# EasyEDA schematic EasyEDA_Source.json
TITLE: Project Lab; REV: v3.e; Date: 2023.03; Sheet: 1/1; Drawn By: bryan costanich; Company: Wilderness Labs
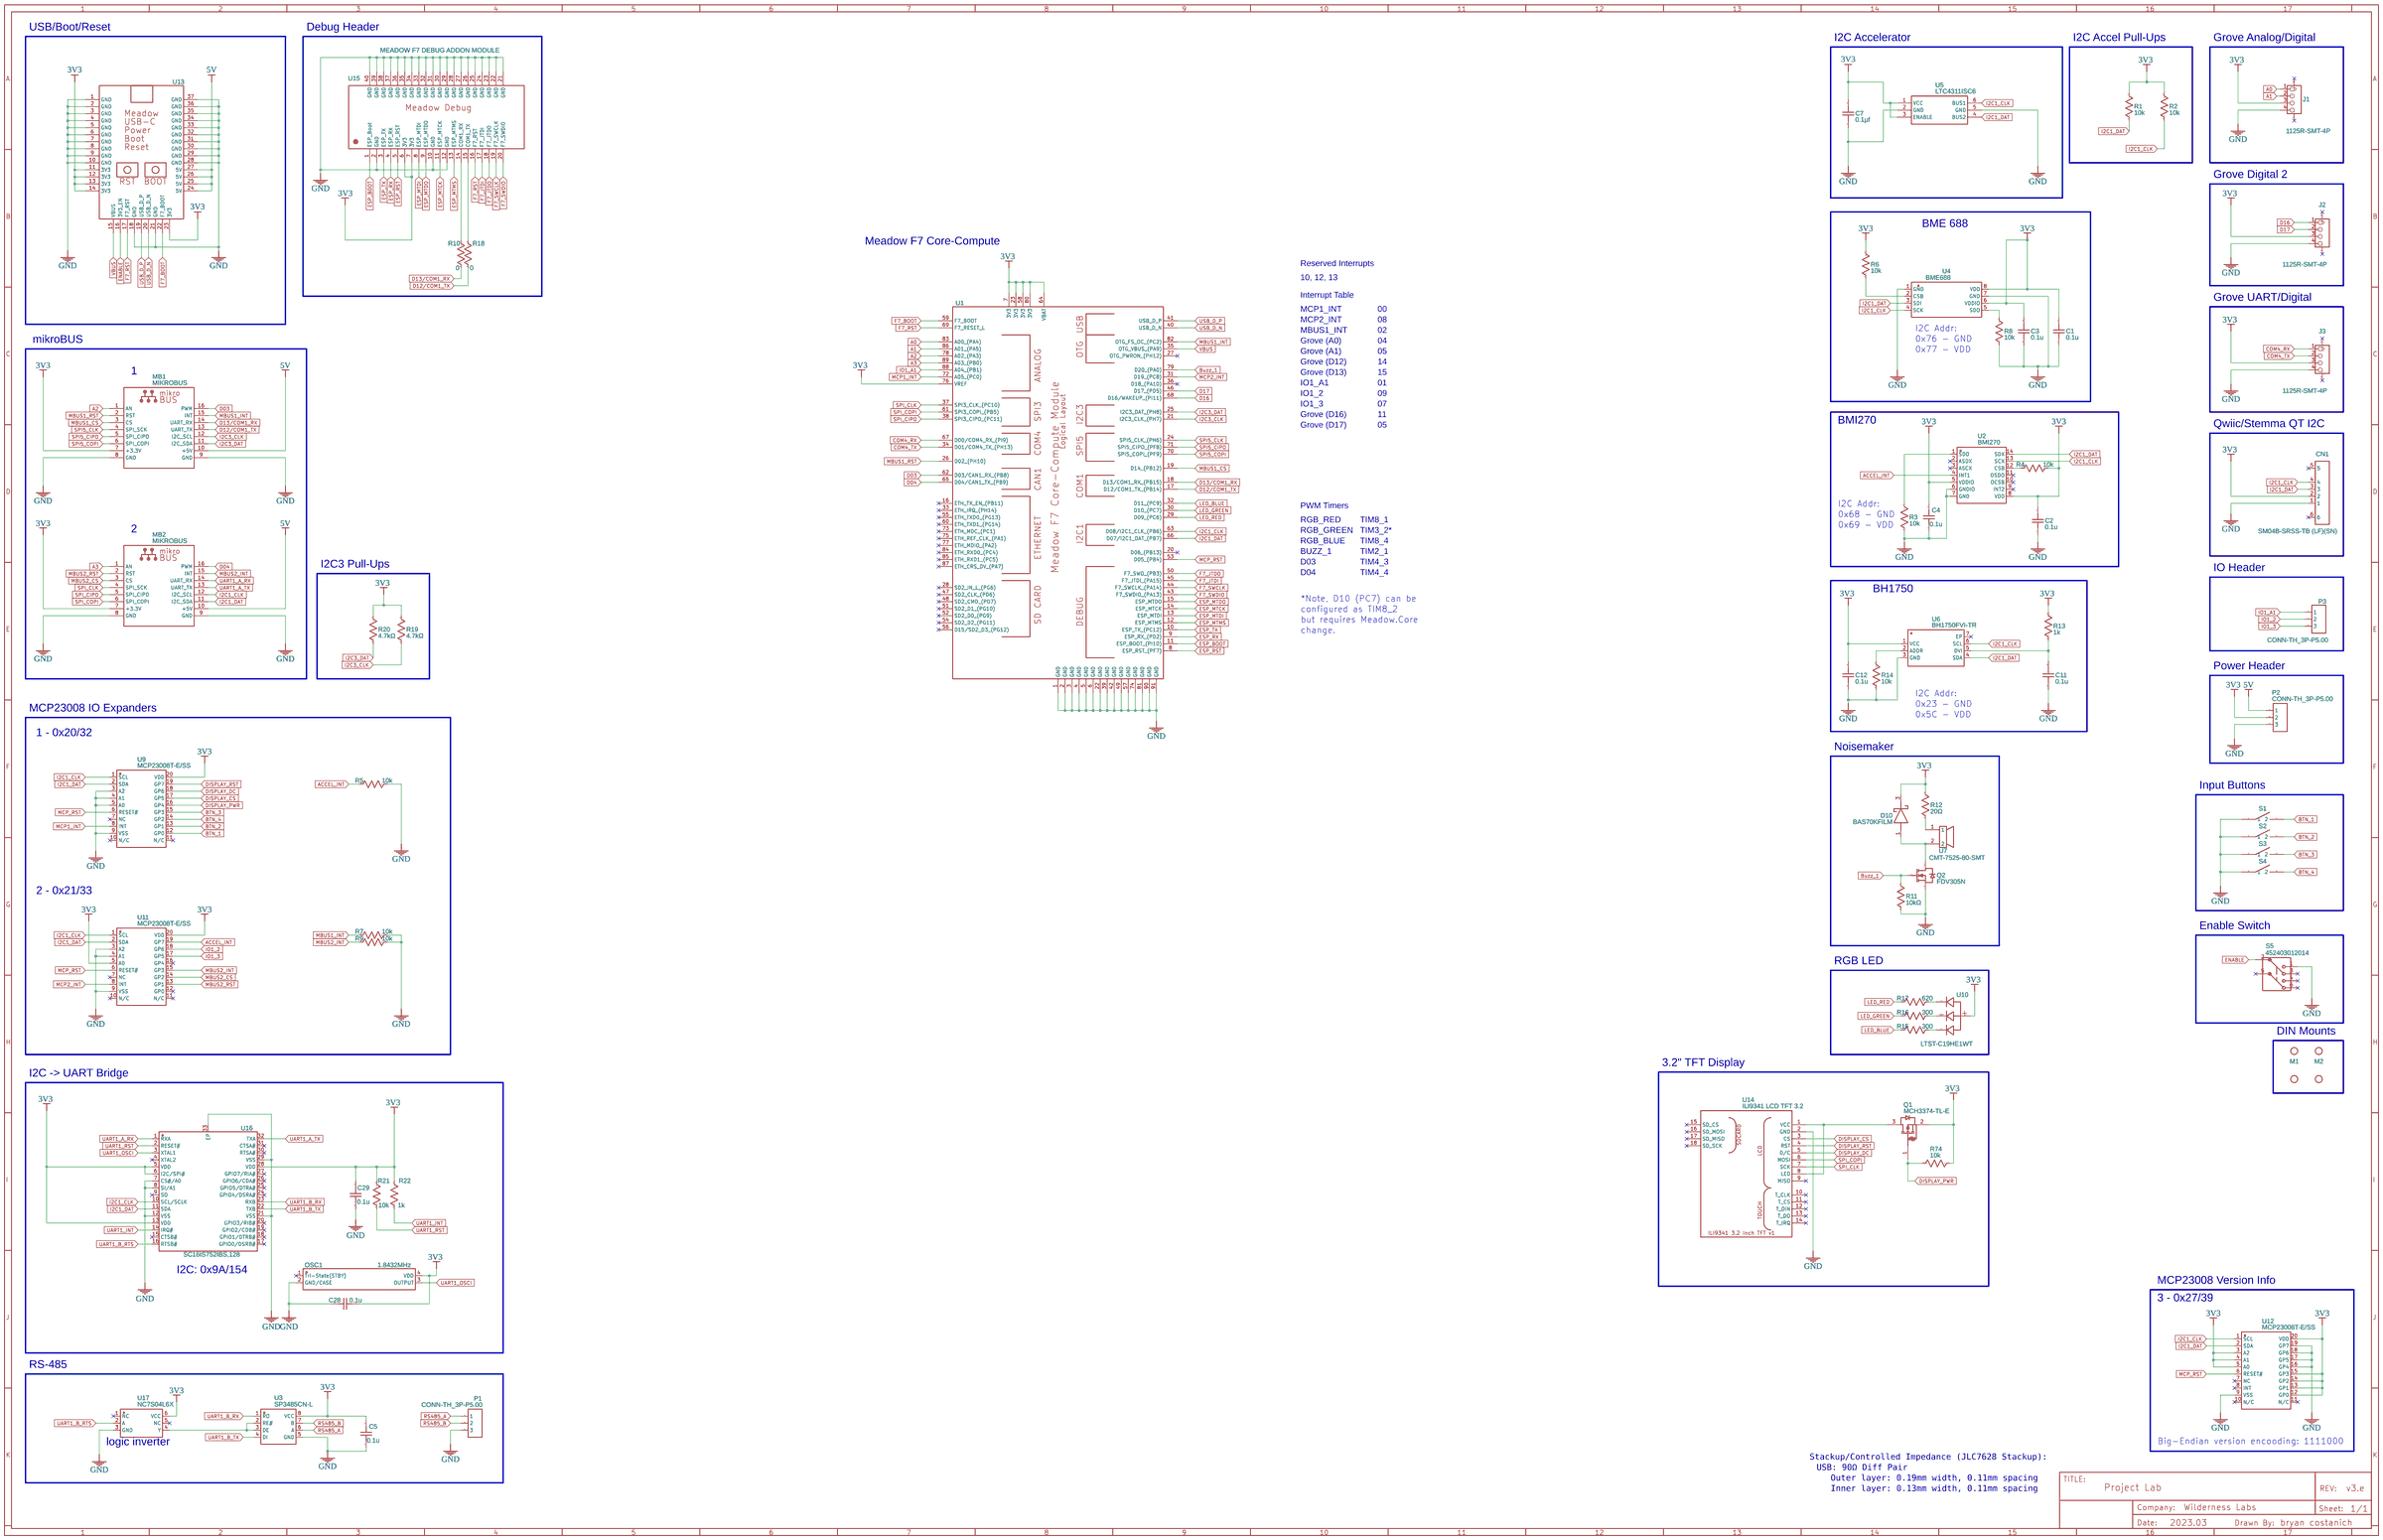
[diagram p0: schematic sheet]

## Parts
C1  0.1u  [C0603]
C2  0.1u  [C0603]
C3  0.1u  [C0603]
C4  0.1u  [C0603]
C5  0.1u  [C0603]
C7  0.1µf  [C0603]
C11  0.1u  [C0603]
C12  0.1u  [C0603]
C28  0.1u  [C0603]
C29  0.1u  [C0603]
CN1  SM04B-SRSS-TB (LF)(SN)  [CONN-SMD_4P-P1.00_SM04B-SRSS-TB-LF-SN]
D10  BAS70KFILM  [SOT323]
J1  1125R-SMT-4P  [HW4-SMD-2.0-90D]
J2  1125R-SMT-4P  [HW4-SMD-2.0-90D]
J3  1125R-SMT-4P  [HW4-SMD-2.0-90D]
M1  DIN_MOUNT_HOLES  [DIN_MOUNT_HOLES]
M2  DIN_MOUNT_HOLES  [DIN_MOUNT_HOLES]
MB1  MIKROBUS  [MIKROBUS_NO_BOARD_OUTLINE]
MB2  MIKROBUS  [MIKROBUS_NO_BOARD_OUTLINE]
OSC1  1.8432MHz  [OSC-SMD_4P-L3.2-W2.5-CJ13-320001210A20]
P1  CONN-TH_3P-P5.00  [CONN-TH_3P-P5.00]
P2  CONN-TH_3P-P5.00  [CONN-TH_3P-P5.00]
P3  CONN-TH_3P-P5.00  [CONN-TH_3P-P5.00]
Q1  MCH3374-TL-E  [-ONSC-MCPH-3_V]
Q2  FDV305N  [SOT-23_L2.9-W1.3-P0.95-LS2.4-BR]
R1  10k  [R0603]
R2  10k  [R0603]
R3  10k  [R0603]
R4  10k  [R0603]
R5  10k  [R0603]
R6  10k  [R0603]
R7  10k  [R0603]
R8  10k  [R0603]
R9  10k  [R0603]
R10  0  [R0603]
R11  10kΩ  [R0603]
R12  20Ω  [R0603]
R13  1k  [R0603]
R14  10k  [R0603]
R15  300  [R0603]
R16  300  [R0603]
R17  620  [R0603]
R18  0  [R0603]
R19  4.7kΩ  [R0603]
R20  4.7kΩ  [R0603]
R21  10k  [R0603]
R22  1k  [R0603]
R74  10k  [R0603]
S1  Up  [TACTILE_SWITCH_TALL]
S2  Down  [TACTILE_SWITCH_TALL]
S3  Down  [TACTILE_SWITCH_TALL]
S4  Down  [TACTILE_SWITCH_TALL]
S5  452403012014  [452403012014]
U1  Meadow F7v2 Core-Compute Module - Logical  [MEADOW_F7V2_CORE_COMPUTE]
U2  BMI270  [LGA-14_L3.0-W2.5-P0.50-BR]
U3  SP3485CN-L  [SOIC-8_L4.9-W3.9-P1.27-LS6.0-BL]
U4  BME688  [LGA-8_L3.0-W3.0-P0.80-TR]
U5  LTC4311ISC6  [SC-70-6_L2.2-W1.3-P0.65-LS2.2-BL]
U6  BH1750FVI-TR  [WSOF-6_L2.6-W1.6-P0.50-TL-EP]
U7  CMT-7525-80-SMT  [CMT-7525S]
U8  WILDERNESS_LABS_LOGO_HORIZONTAL  [WILDERNESS_LABS_LOGO_HORIZONTAL]
U9  MCP23008T-E/SS  [SSOP-20_L7.2-W5.3-P0.65-LS7.8-TL]
U10  LTST-C19HE1WT  [LED-ARRAY-SMD_0603-4P-L1.6-W1.6-BL-RD]
U11  MCP23008T-E/SS  [SSOP-20_L7.2-W5.3-P0.65-LS7.8-TL]
U12  MCP23008T-E/SS  [SSOP-20_L7.2-W5.3-P0.65-LS7.8-TL]
U13  Meadow Core-Compute USB-C, Power, Boot, and Reset Addon Module  [MEADOW CORE-COMPUTE USB-C, POWER, BOOT, RESET ADDON MODULE]
U14  ILI9341 LCD TFT 3.2  [ILI9341 TFT LCD 3.2" - NO BOLT HOLES]
U15  MEADOW F7 DEBUG ADDON MODULE  [MEADOW F7 DEBUG ADDON MODULE]
U16  SC16IS752IBS,128  [HVQFN-32_L5.0-W5.0-P0.50-TL-EP3.1]
U17  NC7S04L6X  [MICROPAK-6_L1.5-W1.0-P0.50-BR]

## Library data of the parts
C1-C5 C11 C12 = C_0402_US: Contributor: LCEDA_Lib; Manufacturer Part: CC0603KRX7R9BB103; Manufacturer: Yageo
C7 = CC0603KRX7R7BB104: Supplier: LCSC; Supplier Part: C108079; Manufacturer: YAGEO; Contributor: LCSC
C28 C29 = C_0603_US: Contributor: LCEDA_Lib; Manufacturer Part: CC0603KRX7R7BB104; Manufacturer: Yageo
CN1 = SM04B-SRSS-TB (LF)(SN): Supplier: LCSC; Supplier Part: C160404; Manufacturer: JST Sales America; Contributor: LCSC; JLCPCB Part Class: Extended Part
D10 = BAS70KFILM: Contributor: quantum love; Manufacturer: ST Microelectronics
J1-J3 = 1125R-SMT-4P: SMD Grove
M1 M2 = DIN_MOUNT_HOLES: Contributor: bryan_6020
MB1 MB2 = MIKROBUS: PatternAgents Mikrobus Socket Pattern; Contributor: PatternAgents
OSC1 = ASE-1.8432MHZ-C-T3: Manufacturer: ABRACON; Manufacturer Part: ASE-1.8432MHZ-LC-T; link: https://atta.szlcsc.com/upload/public/pdf/source/20181115/C276422_72743FC1FF5AED23884804C235FB4380.pdf; Contributor: lcsc; JLCPCB Part Class: Extended Part
P1-P3 = CONN-TH_3P-P5.00: Supplier Part: WM15826-ND; Supplier: Digi-Key; Manufacturer: Molex; Manufacturer Part: 39890-0303; Contributor: LCEDA_Lib
Q1 = MCH3374-TL-E: P-Channel Power MOSFET, -12 V, -3 A, 70 mOhm, 3-Pin MCPH, Pb-Free, Tape and Reel; Manufacturer: OnSemi
Q2 = 2N7002: Manufacturer: Fairchild; Supplier Part: C65189; Contributor: LCEDA_Lib; Package Display: No
R1 R2 = Res_0603(1/10W)_US: Manufacturer Part: RC0603FR-0710KL; Manufacturer: Yageo
R3-R9 R11 R14 = R_0402_US: Contributor: LCEDA_Lib; Manufacturer Part: RC0603FR-0710KL; Manufacturer: Yageo
R10 R18 = R_0603_US: Contributor: LCEDA_Lib; Manufacturer Part: RC0603JR-070RL; Manufacturer: Yageo
R12 = R_0402_US: Contributor: LCEDA_Lib; Manufacturer Part: RC0603FR-0720RL; Manufacturer: Yageo
R13 = R_0603_US: Contributor: LCEDA_Lib; Manufacturer Part: RC0603FR-071KL; Manufacturer: Yageo
R15 R16 = R_0603_US: Contributor: LCEDA_Lib; Manufacturer Part: RC0603FR-07300RL; Manufacturer: Yageo
R17 = R_0603_US: Contributor: LCEDA_Lib; Manufacturer Part: RC0603FR-07620RL; Manufacturer: Yageo
R19 R20 = Res_0603(1/10W)_US: Manufacturer Part: RC0603FR-074K7L; Manufacturer: Yageo
R21 R74 = R_0603_US: Contributor: LCEDA_Lib; Manufacturer Part: RC0603FR-0710KL; Manufacturer: Yageo
R22 = R_0402_US: Contributor: LCEDA_Lib; Manufacturer Part: RC0603FR-071KL; Manufacturer: Yageo
S1-S4 = Tactile Switch 6x6 SMD: Contributor: vietninh
S5 = 452403012014: WS-SLSV; Contributor: fsadrzad; Manufacturer: Wurth Elektronik
U1 = Meadow F7v2 Core-Compute Module - Logical: Manufacturer: Wilderness Labs; link: https://www.wildernesslabs.co/hardware; Contributor: bryan_6020
U2 = BMI270: Supplier: LCSC; Supplier Part: C2836813; Manufacturer: null; Contributor: LCSC; JLCPCB Part Class: Extended Part
U3 = SP3485CN-L: Supplier: LCSC; Supplier Part: C916153; Manufacturer: MaxLinear; Contributor: LCSC; JLCPCB Part Class: Extended Part
U4 = BME680: Manufacturer: Bosch Sensortec; Contributor: LCSC; LCSC Assembly: Yes; SMT Type: Extend
U5 = LTC4311ISC6: Manufacturer Part: LTC4311ISC6#TRPBF; Contributor: Thomas_HUMZA
U6 = BH1750FVI-TR: Supplier: LCSC; Manufacturer: ROHM; Supplier Part: C78960; JLCPCB Part Class: Extended Part
U7 = CMT-7525-80-SMT: Manufacturer: CUI Devices; Contributor: bryanf
U8 = WILDERNESS_LABS_LOGO_HORIZONTAL: Contributor: bryan costanich
U9 U11 U12 = MCP23008T-E/SS: Supplier: LCSC; Supplier Part: C629435; Manufacturer: Microchip Tech; Contributor: LCSC
U10 = LTST-C19HE1WT-H: Supplier: LCSC; Supplier Part: C427425; Manufacturer: Lite-On; Contributor: LCSC; JLCPCB Part Class: Extended Part
U13 = Meadow Core-Compute USB-C, Power, Boot, and Reset Addon Module: Manufacturer: Wilderness Labs; Contributor: bryan_6020
U14 = ILI9341 LCD TFT 3.2: Contributor: Lutfito danuega
U15 = MEADOW F7 DEBUG ADDON MODULE: Contributor: bryan_6020
U16 = SC16IS752IBS,128: Supplier: LCSC; Supplier Part: C2678025; Manufacturer: NXP(恩智浦); Contributor: LCSC; JLCPCB Part Class: Extended Part
U17 = NC7S04L6X: Supplier: LCSC; Supplier Part: C895519; Manufacturer: onsemi(安森美); Contributor: LCSC; JLCPCB Part Class: Extended Part

## Nets
3V3: C1.2 C2.2 C3.2 C4.2 C5.2 C7.2 C12.2 C28.1 C29.2 CN1.2 D10.3(K) J1.3 J2.3 J3.3 MB1.7(+3.3V) MB2.7(+3.3V) OSC1.4(VDD) P2.2 Q1.2(S) R1.2 R2.2 R4.1 R6.2 R12.2 R13.2 R19.2 R20.2 R21.1 R22.1 R74.1 U1.7(3V3) U1.23(3V3) U1.58(3V3) U1.64(VBAT) U1.76(VREF) U1.80(3V3) U2.5(VDDIO) U2.8(VDD) U3.8(VCC) U4.6(VDDIO) U4.8(VDD) U5.1(VCC) U5.3(ENABLE) U6.1(VCC) U9.20(VDD) U10.4(A) U11.5(A0) U11.20(VDD) U12.3(A2) U12.4(A1) U12.5(A0) U12.12(GP0) U12.13(GP1) U12.14(GP2) U12.15(GP3) U12.20(VDD) U13.11(3V3) U13.12(3V3) U13.13(3V3) U13.14(3V3) U13.23(3V3) U15.6(3V3) U15.7(3V3) U16.5(VDD) U16.6(I2C/SPI#) U16.13(VDD) U16.28(VDD) U17.6(VCC)
5V: MB1.10(+5V) MB2.10(+5V) P2.1 U13.24(5V) U13.25(5V) U13.26(5V) U13.27(5V)
GND: C1.1 C2.1 C3.1 C4.1 C5.1 C7.1 C11.1 C12.1 C28.2 C29.1 CN1.1 J1.4 J2.4 J3.4 MB1.8(GND) MB1.9(GND) MB2.8(GND) MB2.9(GND) OSC1.2(GND/CASE) P1.3 P2.3 Q2.2(S) R3.1 R5.1 R7.1 R8.1 R9.1 R11.1 R14.1 S1.A1(1) S2.A1(1) S3.A1(1) S4.A1(1) S5.1 U1.1(GND) U1.2(GND) U1.3(GND) U1.4(GND) U1.5(GND) U1.6(GND) U1.22(GND) U1.39(GND) U1.42(GND) U1.49(GND) U1.57(GND) U1.74(GND) U1.81(GND) U1.90(GND) U1.91(GND) U2.6(GNDIO) U2.7(GND) U3.5(GND) U4.1(GND) U4.7(GND) U5.2(GND) U5.5(GND) U6.3(GND) U9.3(A2) U9.4(A1) U9.5(A0) U9.9(VSS) U11.3(A2) U11.4(A1) U11.9(VSS) U12.9(VSS) U12.16(GP4) U12.17(GP5) U12.18(GP6) U12.19(GP7) U13.1(GND) U13.2(GND) U13.3(GND) U13.4(GND) U13.5(GND) U13.6(GND) U13.7(GND) U13.8(GND) U13.9(GND) U13.10(GND) U13.18(GND) U13.21(GND) U13.28(GND) U13.29(GND) U13.30(GND) U13.31(GND) U13.32(GND) U13.33(GND) U13.34(GND) U13.35(GND) U13.36(GND) U13.37(GND) U14.2(GND) U15.2(GND) U15.10(GND) U15.12(GND) U15.21(GND) U15.22(GND) U15.23(GND) U15.24(GND) U15.25(GND) U15.26(GND) U15.27(GND) U15.28(GND) U15.29(GND) U15.30(GND) U15.31(GND) U15.32(GND) U15.33(GND) U15.34(GND) U15.35(GND) U15.36(GND) U15.37(GND) U15.38(GND) U15.39(GND) U15.40(GND) U16.7(CS#/A0) U16.8(SI/A1) U16.12(VSS) U16.21(VSS) U16.29(VSS) U16.33(EP) U17.3(GND)
VBUS: U1.35(OTG_VBUS (PA9)) U13.15(VBUS)
A0: J1.1 U1.83(A00 (PA4))
A1: J1.2 U1.86(A01 (PA5))
A2: MB1.1(AN) U1.78(A02 (PA3))
A3: MB2.1(AN) U1.89(A03 (PB0))
ACCEL_INT: R5.2 U2.4(INT1) U11.19(GP7)
BTN_1: S1.B1(2) U9.12(GP0)
BTN_2: S2.B1(2) U9.13(GP1)
BTN_3: S3.B1(2) U9.15(GP3)
BTN_4: S4.B1(2) U9.14(GP2)
Buzz_1: Q2.1(G) R11.2 U1.79(D20 (PA0))
COM4_RX: J3.1 U1.67(D00/COM4_RX (PI9))
COM4_TX: J3.2 U1.34(D01/COM4_TX (PH13))
D03: MB1.16(PWM) U1.62(D03/CAN1_RX (PB8))
D04: MB2.16(PWM) U1.65(D04/CAN1_TX (PB9))
D12/COM1_TX: MB1.13(UART_TX) R18.1 U1.17(D12/COM1_TX (PB14))
D13/COM1_RX: MB1.14(UART_RX) R10.1 U1.18(D13/COM1_RX (PB15))
D16: J2.1 U1.68(D16/WAKEUP (PI11))
D17: J2.2 U1.46(D17 (PD5))
DISPLAY_CS: U9.17(GP5) U14.3(CS)
DISPLAY_DC: U9.18(GP6) U14.5(D/C)
DISPLAY_PWR: Q1.1(G) R74.2 U9.16(GP4)
DISPLAY_RST: U9.19(GP7) U14.4(RST)
ENABLE: S5.2(1) U13.16(3V3_EN)
ESP_BOOT: U1.11(ESP_BOOT (PI10)) U15.1(ESP_Boot)
ESP_MTCK: U1.14(ESP_MTCK) U15.11(ESP_MTCK)
ESP_MTDI: U1.13(ESP_MTDI) U15.8(ESP_MTDI)
ESP_MTDO: U1.15(ESP_MTDO) U15.9(ESP_MTDO)
ESP_MTMS: U1.12(ESP_MTMS) U15.13(ESP_MTMS)
ESP_RST: U1.8(ESP_RST (PF7)) U15.5(ESP_RST)
ESP_RX: U1.9(ESP_RX (PD2)) U15.4(ESP_RX)
ESP_TX: U1.10(ESP_TX (PC12)) U15.3(ESP_TX)
F7_BOOT: U1.59(F7_BOOT) U13.22(F7_BOOT)
F7_JTDI: U1.45(F7_JTDI (PA15)) U15.17(F7_JTDI)
F7_JTDO: U1.50(F7_SWO (PB3)) U15.18(F7_JTDO)
F7_RST: U1.69(F7_RESET_L) U13.17(F7_RST) U15.16(F7_RST)
F7_SWCLK: U1.44(F7_SWCLK (PA14)) U15.19(F7_SWCLK)
F7_SWDIO: U1.43(F7_SWDIO (PA13)) U15.20(F7_SWDIO)
I2C1_CLK: CN1.4 MB2.12(I2C_SCL) R2.1 U1.63(D08/I2C1_CLK (PB6)) U2.13(SCX) U4.4(SCK) U5.6(BUS1) U6.6(SCL) U9.1(SCL) U11.1(SCL) U12.1(SCL) U16.10(SCL/SCLK)
I2C1_DAT: CN1.3 MB2.11(I2C_SDA) R1.1 U1.66(D07/I2C1_DAT (PB7)) U2.14(SDX) U4.3(SDI) U5.4(BUS2) U6.4(SDA) U9.2(SDA) U11.2(SDA) U12.2(SDA) U16.11(SDA)
I2C3_CLK: MB1.12(I2C_SCL) R19.1 U1.21(I2C3_CLK (PH7))
I2C3_DAT: MB1.11(I2C_SDA) R20.1 U1.25(I2C3_DAT (PH8))
IO1_2: P3.2 U11.18(GP6)
IO1_3: P3.3 U11.17(GP5)
IO1_A1: P3.1 U1.88(A04 (PB1))
LED_BLUE: R15.1 U1.32(D11 (PC9))
LED_GREEN: R16.1 U1.30(D10 (PC7))
LED_RED: R17.1 U1.29(D09 (PC6))
MBUS1_CS: MB1.3(CS) U1.19(D14 (PB12))
MBUS1_INT: MB1.15(INT) R7.2 U1.82(OTG_FS_OC (PC2))
MBUS1_RST: MB1.2(RST) U1.26(D02 (PH10))
MBUS2_CS: MB2.3(CS) U11.14(GP2)
MBUS2_INT: MB2.15(INT) R9.2 U11.15(GP3)
MBUS2_RST: MB2.2(RST) U11.13(GP1)
MCP1_INT: U1.72(A05 (PC0)) U9.8(INT)
MCP2_INT: U1.31(D19 (PC8)) U11.8(INT)
MCP_RST: U1.53(D05 (PB4)) U9.6(RESET#) U11.6(RESET#) U12.6(RESET#)
RS485_A: P1.1 U3.6(A)
RS485_B: P1.2 U3.7(B)
SPI5_CIPO: MB1.5(SPI_CIPO) U1.71(SPI5_CIPO (PF8))
SPI5_CLK: MB1.4(SPI_SCK) U1.24(SPI5_CLK (PH6))
SPI5_COPI: MB1.6(SPI_COPI) U1.70(SPI5_COPI (PF9))
SPI_CIPO: MB2.5(SPI_CIPO) U1.38(SPI3_CIPO (PC11))
SPI_CLK: MB2.4(SPI_SCK) U1.37(SPI3_CLK (PC10)) U14.7(SCK)
SPI_COPI: MB2.6(SPI_COPI) U1.61(SPI3_COPI (PB5)) U14.6(MOSI)
UART1_A_RX: MB2.14(UART_RX) U16.1(RXA)
UART1_A_TX: MB2.13(UART_TX) U16.32(TXA)
UART1_B_RTS: U16.16(RTSB#) U17.2(A)
UART1_B_RX: U3.1(RO) U16.23(RXB)
UART1_B_TX: U3.4(DI) U16.22(TXB)
UART1_INT: R22.2 U16.14(IRQ#)
UART1_OSCI: OSC1.3(OUTPUT) U16.3(XTAL1)
UART1_RST: R21.2 U16.2(RESET#)
USB_D_N: U1.40(USB_D_N) U13.20(USB_D_N)
USB_D_P: U1.41(USB_D_P) U13.19(USB_D_P)
Net-(C11-2): C11.2 R13.1 U6.5(DVI)
Net-(D10-1): D10.1(A) Q2.3(D) U7.2
Net-(Q1-3): Q1.3(D) U14.1(VCC) U14.8(LED)
Net-(R3-2): R3.2 U2.1(SDO)
Net-(R4-2): R4.2 U2.12(CSB)
Net-(R6-1): R6.1 U4.2(CSB)
Net-(R8-2): R8.2 U4.5(SDO)
Net-(R10-2): R10.2 U15.14(COM1_RX)
Net-(R12-1): R12.1 U7.1
Net-(R14-2): R14.2 U6.2(ADDR)
Net-(R15-2): R15.2 U10.3(C3)
Net-(R16-2): R16.2 U10.2(C2)
Net-(R17-2): R17.2 U10.1(C1)
Net-(R18-2): R18.2 U15.15(COM1_TX)
Net-(U3-2): U3.2(RE#) U3.3(DE) U17.4(Y)

Not connected (* = marked no-connect by the designer): CN1 5* 6*; J1 SS1* SS2*; J2 SS1* SS2*; J3 SS1* SS2*; OSC1 1(Tri-State(STBY))*; S5 3(1)* 4(1)* 5(2)* 6(1)*; U1 16(ETH_TX_EN (PB11))* 20(D06 (PB13))* 27(OTG_PWRON (PH12))* 28(SD2_IN_L (PG6))* 33(ETH_IRQ (PH14))* 36(D18 (PA10))* 47(SD2_CLK (PD6))* 48(SD2_CMD (PD7))* 51(SD2_D1 (PG10))* 52(SD2_D0 (PG9))* 54(SD2_D2 (PG11))* 55(ETH_TXD0 (PG13))* 56(D15/SD2_D3 (PG12))* 60(ETH_TXD1 (PG14))* 73(ETH_MDC (PC1))* 75(ETH_REF_CLK (PA1))* 77(ETH_MDIO (PA2))* 84(ETH_RXD0 (PC4))* 85(ETH_RXD1 (PC5))* 87(ETH_CRS_DV (PA7))*; U2 2(ASDX)* 3(ASCX)* 9(INT2)* 10(OCSB)* 11(OSDO)*; U6 7(EP)*; U9 7(NC)* 10(N/C)* 11(N/C)*; U11 7(NC)* 10(N/C)* 11(N/C)* 12(GP0)* 16(GP4)*; U12 7(NC)* 8(INT)* 10(N/C)* 11(N/C)*; U14 9(MISO)* 10(T_CLK)* 11(T_CS)* 12(T_DIN)* 13(T_DO)* 14(T_IRQ)* 15(SD_CS)* 16(SD_MOSI)* 17(SD_MISO)* 18(SD_SCK)*; U16 4(XTAL2)* 9(SO)* 15(CTSB#)* 17(GPIO0/DSRB#)* 18(GPIO1/DTRB#)* 19(GPIO2/CDB#)* 20(GPIO3/RIB#)* 24(GPIO4/DSRA#)* 25(GPIO5/DTRA#)* 26(GPIO6/CDA#)* 27(GPIO7/RIA#)* 30(RTSA#)* 31(CTSA#)*; U17 1(NC)* 5(NC)*

## Notes on the sheet
- USB/Boot/Reset
- Debug Header
- I2C Accelerator
- I2C Accel Pull-Ups
- Grove Analog/Digital
- Grove Digital 2
- BME 688
- Meadow F7 Core-Compute
- Reserved Interrupts
- 10, 12, 13
- Interrupt Table
- Grove UART/Digital
- MCP1_INT
- 00
- MCP2_INT
- 08
- MBUS1_INT
- 02
- I2C Addr:
- mikroBUS
- Grove (A0)
- 04
- 0x76 - GND
- 0x77 - VDD
- Grove (A1)
- 05
- Grove (D12)
- 14
- 1
- Grove (D13)
- 15
- IO1_A1
- 01
- IO1_2
- 09
- IO1_3
- 07
- Grove (D16)
- 11
- Grove (D17)
- 05
- BMI270
- Qwiic/Stemma QT I2C
- PWM Timers
- I2C Addr:
- 0x68 - GND
- RGB_RED
- TIM8_1
- 0x69 - VDD
- 2
- RGB_GREEN
- TIM3_2*
- RGB_BLUE
- TIM8_4
- BUZZ_1
- TIM2_1
- I2C3 Pull-Ups
- D03
- TIM4_3
- D04
- TIM4_4
- IO Header
- BH1750
- *Note, D10 (PC7) can be
- configured as TIM8_2
- but requires Meadow.Core
- change.
- Power Header
- I2C Addr:
- 0x23 - GND
- MCP23008 IO Expanders
- 0x5C - VDD
- 1 - 0x20/32
- Noisemaker
- Input Buttons
- 2 - 0x21/33
- Enable Switch
- RGB LED
- DIN Mounts
- 3.2" TFT Display
- I2C -> UART Bridge
- I2C: 0x9A/154
- MCP23008 Version Info
- 3 - 0x27/39
- RS-485
- logic inverter
- Big-Endian version encooding: 1111000
- Stackup/Controlled Impedance (JLC7628 Stackup):
- USB: 90Ω Diff Pair
- Outer layer: 0.19mm width, 0.11mm spacing
- Inner layer: 0.13mm width, 0.11mm spacing
